# Altium project current_sense.PrjPcb
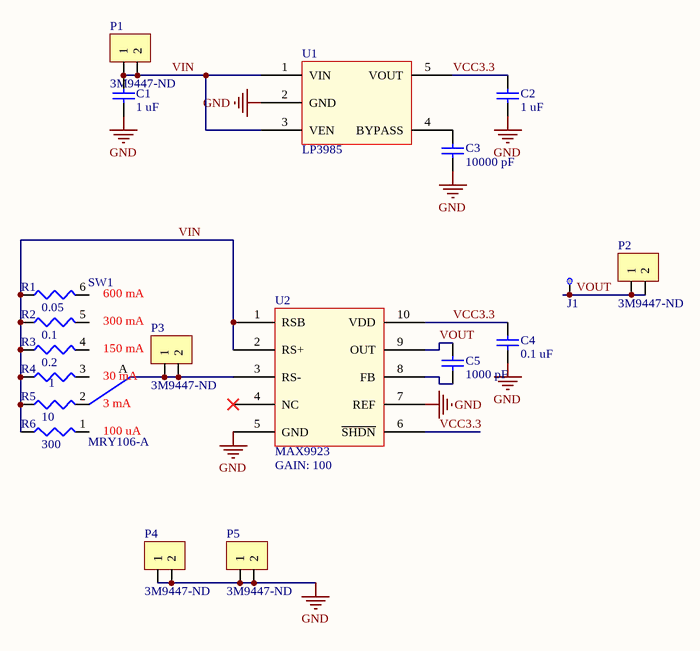
[diagram p0: current_sense.SchDoc]
1 sheet, 20 parts. Net scope: global (net labels, ports and power ports of the same name join across sheets).
Board file: current_sense.PcbDoc

## Sheet current_sense.SchDoc
size Letter

### Parts
C1  value 1 uF  [0603]  (hidden comment: Ceramic capacitor)
C2  value 1 uF  [0603]  (hidden comment: Ceramic capacitor)
C3  value 10000 pF  [0603]  (hidden comment: Ceramic capacitor)
C4  value 0.1 uF  [0603]  (hidden comment: Ceramic capacitor)
C5  value 1000 pF  [0603]  (hidden comment: Ceramic capacitor)
J1  5004  [TestPoint]  (value not drawn)
P1  Supplier Part Number 1: 3M9447-ND  [1x2 header]  (hidden comment: 1 x 2 header)
P2  Supplier Part Number 1: 3M9447-ND  [1x2 header]  (hidden comment: 1 x 2 header)
P3  Supplier Part Number 1: 3M9447-ND  [1x2 header]  (hidden comment: 1 x 2 header)
P4  Supplier Part Number 1: 3M9447-ND  [1x2 header]  (hidden comment: 1 x 2 header)
P5  Supplier Part Number 1: 3M9447-ND  [1x2 header]  (hidden comment: 1 x 2 header)
R1  value 0.05  [C1206]  (hidden comment: Res3)
R2  value 0.1  [VCS1610]  (hidden comment: Res3)
R3  value 0.2  [CSM3637]  (hidden comment: Res3)
R4  value 1  [VCS1610]  (hidden comment: Res3)
R5  value 10  [6-0805_N]  (hidden comment: Res3)
R6  value 300  [6-0805_N]  (hidden comment: Res3)
SW1  MRY106-A  [MRY switch]
U1  LP3985  [SOT23-5]
U2  MAX9923  GAIN: 100  [10umax]

### Nets
GND: C1.2 C2.2 C3.2 C4.2 P4.1 P4.2 P5.1 P5.2 U1.2(GND) U2.5(GND) U2.7(REF)
VCC3.3: C2.1 C4.1 U1.5(VOUT) U2.6(~{SHDN}) U2.10(VDD)
VIN: C1.1 P1.1 P1.2 R1.1 R2.1 R3.1 R4.1 R5.1 R6.1 U1.1(VIN) U1.3(VEN) U2.1(RSB) U2.2(RS+)
VOUT: C5.1 J1.1(TB) P2.1 P2.2 U2.9(OUT)
NetC3_1: C3.1 U1.4(BYPASS)
NetC5_2: C5.2 U2.8(FB)
NetP3_1: P3.1 P3.2 SW1.A U2.3(RS-)
NetR1_2: R1.2 SW1.6
NetR2_2: R2.2 SW1.5
NetR3_2: R3.2 SW1.4
NetR4_2: R4.2 SW1.3
NetR5_2: R5.2 SW1.2
NetR6_2: R6.2 SW1.1

Not connected (* = marked no-connect by the designer): U2 4(NC)*

### Notes on the sheet
- (near SW1) 600 mA
- (near SW1) 300 mA
- (near SW1) 150 mA
- (near SW1) 30 mA
- (near SW1) 3 mA
- (near SW1) 100 uA
- Title
- Date:
- Author:
- Revision:
- Sheet
- of
- University of Michigan
- File:

### Library data of the parts
C1 C2 = C_1u_0603_ceramic: Ceramic capacitor, 1 uF, 0603 package; Manufacture: TDK; voltage rated: 10V; tolerance: 10%; package: 0603; Supplier 1: Digi-Key; Supplier Part Number 1: 445-1321-1-ND
C3 = C_10000p_0603_ceramic: Ceramic capacitor, 10000 pF, 0603 package; Manufacture: TDK; voltage rated: 25V; tolerance: 10%; package: 0603; Supplier 1: Digi-Key; Supplier Part Number 1: 445-5100-1-ND
C4 = C_0.1u_0603_ceramic: Ceramic capacitor, 0.1 uF, 0603 package; Manufacture: TDK; voltage rated: 25V; tolerance: 10%; package: 0603; Supplier 1: Digi-Key; Supplier Part Number 1: 445-1316-1-ND
C5 = C_1000p_0603_ceramic: Ceramic capacitor, 1000 pF, 0603 package; Manufacture: TDK; voltage rated: 50V; tolerance: 10%; package: 0603; Supplier 1: Digi-Key; Supplier Part Number 1: 445-5659-1-ND
J1 = TestPoint: TEST POINT PC MINI .040"D YELLOW; Supplier 1: Digi-Key; Supplier Part Number 1: 5004K-ND; datasheet: http://mail.keyelco.com/ENG._DEPT/PDF%20CAT%20NO%20Drawings/5004.pdf
P1-P5 = 1 x 2 header: 100 mils standard header; Supplier 1: Digi-Key
R1-R6 = Res3: Resistor; Published: 8-Jun-2000; LatestRevisionDate: 29-May-2009; LatestRevisionNote: IPC-7351 Footprint Added.; PackageReference: J1-0603; Publisher: Altium Limited; PackageDescription: Chip Resistor
SW1 = MRY106-A: SW ROTARY SP BLK KNOB 125V; Supplier 1: Digi-Key; Supplier Part Number 1: 360-2379-ND
U1 = LP3985: 150mA Low-Noise Ultra Low-Dropout CMOS Voltage Regulator; Supplier 1: Digi-Key; Supplier Part Number 1: LP3985IM5-3.3/NOPBCT-ND
U2 = MAX9923: ultra-precision, high-side current-sense amplifier; Supplier 1: Digi-Key; Supplier Part Number 1: MAX9923HEUB+-ND